# Altium schematic sheet Mainamp_schematic.SchDoc
size A4; SheetNumber: 3; SheetTotal: 3
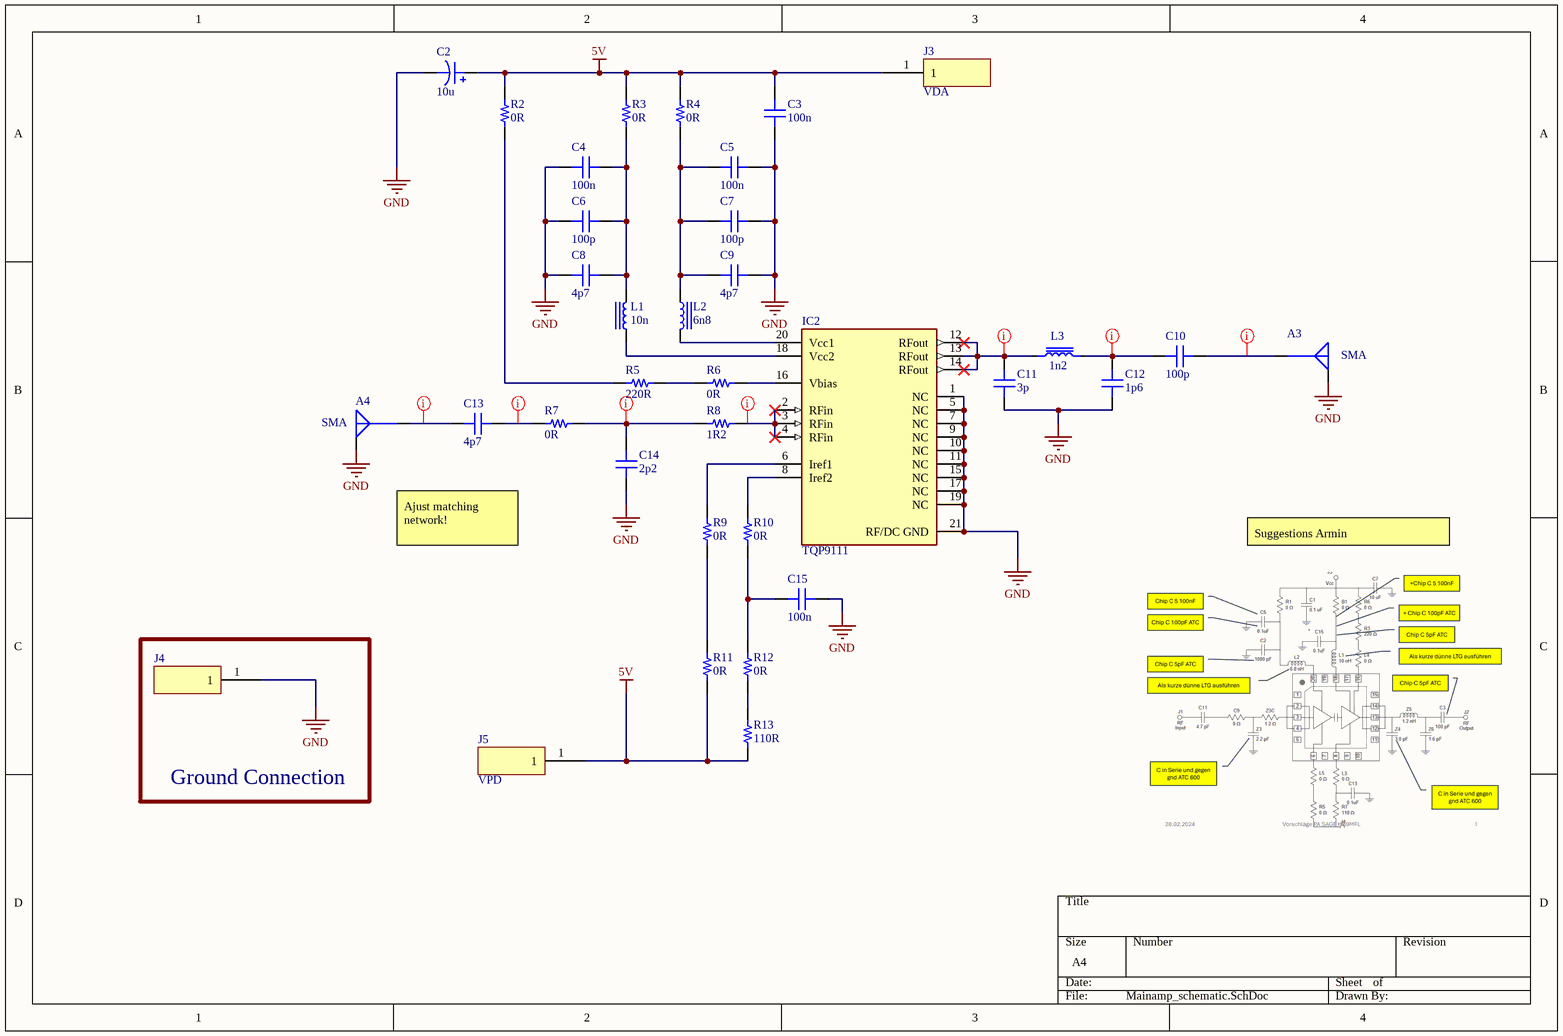
[diagram p0: Mainamp_schematic.SchDoc]

## Parts
A3  Connector Style: SMA  [MOLEX SD-73251-115]  (hidden comment: 0732511150)
A4  Connector Style: SMA  [MOLEX SD-73251-115]  (hidden comment: 0732511150)
C2  10u  [CAP POL 2917_7343]
C3  100n  [CAP 0603_1608]
C4  100n  [CAP 0603_1608]
C5  100n  [CAP 0603_1608]
C6  100p  [CAP 0603_1608 RF]
C7  100p  [CAP 0603_1608 RF]
C8  4p7  [CAP 0402_1005 RF]
C9  4p7  [CAP 0402_1005 RF]
C10  100p  [CAP 0402_1005 RF]
C11  3p  [CAP 0402_1005 RF]  (mechanical)
C12  1p6  [CAP 0402_1005 RF]  (mechanical)
C13  4p7  [CAP 0402_1005 RF]
C14  2p2  [CAP 0402_1005 RF]  (mechanical)
C15  100n  [CAP 0603_1608]
IC2  TQP9111  [FP-TQP9111-MFG]
J3  Nail_Head  [Nail_Head]  (value not drawn)
J4  Nail_Head  [Nail_Head]  (value not drawn)
J5  Nail_Head  [Nail_Head]  (value not drawn)
L1  10n  [IND 0603_1608 RF WW]
L2  6n8  [IND 0402_1005 RF WW]
L3  1n2  [0402]
R2  0R  [RES 0603_1608]
R3  0R  [RES 0603_1608]
R4  0R  [RES 0603_1608]
R5  220R  [RES 0603_1608]
R6  0R  [RES 0603_1608]
R7  0R  [RES 0402_1005]
R8  1R2  [RES 0402_1005]
R9  0R  [RES 0603_1608]
R10  0R  [RES 0603_1608]
R11  0R  [RES 0603_1608]
R12  0R  [RES 0603_1608]
R13  110R  [RES 0603_1608]

## Blocks framed on the sheet
Ground Connection: J4

## Nets
5V: C2.1 C3.2 J3.1 J5.1 R2.2 R3.2 R4.2 R11.1 R13.1
GND: A3.G A4.G C2.2 C3.1 C4.1 C5.2 C6.1 C7.2 C8.1 C9.2 C11.1 C12.1 C14.1 C15.2 IC2.1(NC) IC2.5(NC) IC2.7(NC) IC2.9(NC) IC2.10(NC) IC2.11(NC) IC2.15(NC) IC2.17(NC) IC2.19(NC) IC2.21(RF/DC_GND) J4.1
NetA3_S: A3.S C10.2
NetA4_S: A4.S C13.1
NetC4_2: C4.2 C6.2 C8.2 L1.2 R3.1
NetC5_1: C5.1 C7.1 C9.1 L2.2 R4.1
NetC10_1: C10.1 C12.2 L3.2
NetC11_2: C11.2 IC2.12(RFout) IC2.13(RFout) IC2.14(RFout) L3.1
NetC13_2: C13.2 R7.1
NetC14_2: C14.2 R7.2 R8.1
NetC15_1: C15.1 R10.1 R12.1
NetIC2_2: IC2.2(RFin) IC2.3(RFin) IC2.4(RFin) R8.2
NetIC2_6: IC2.6(Iref1) R9.2
NetIC2_8: IC2.8(Iref2) R10.2
NetIC2_16: IC2.16(Vbias) R6.1
NetIC2_18: IC2.18(Vcc2) L1.1
NetIC2_20: IC2.20(Vcc1) L2.1
NetR2_1: R2.1 R5.1
NetR5_2: R5.2 R6.2
NetR9_1: R9.1 R11.2
NetR12_2: R12.2 R13.2

## Layout directives
net class CPWG: NetA3_S, NetA4_S, NetC10_1, NetC11_2, NetC13_2, NetC14_2, NetIC2_2

## Notes on the sheet
- (near J3) VDA
- Ajust matching network!
- Suggestions Armin
- (near J5) VPD

## Library data of the parts
A3 A4 = 0732511150: CONN SMA RCPT STR 50OHM EDGE MNT; Manufacturer: Molex; Connector Type: Receptacle, Female Socket; Contact Termination: Solder; Frequency - Max: 18 GHz; Number of Ports: 1; Part Number: 0732511150; ComponentLink1Description: Datasheet; ComponentLink1URL: https://www.molex.com/pdm_docs/ps/PS-89675-346.pdf; ComponentLink2Description: DigiKey Link; ComponentLink2URL: https://www.digikey.com/en/products/detail/molex/0732511150/1465156; Fastening Type: Threaded; Housing Color: Gold; Impedance: 50Ohm; LastUpdated: 29/06/2022 18:06:18; Lifecycle Status: Active; Minimum Order: 1; Mounting Type: Board Edge, End Launch; Packaging: Tray; Part Status: Active; Price: 2.16; Series: 73251; Shield Termination: Solder; Supplier 1: DigiKey; Supplier Part Number 1: WM5534-ND
C2 = 293D106X0050E2TE3: CAP TANT 10UF 20% 50V 2917; manufacturer: Vishay Sprague; Manufacturer Size Code: E; Capacitance: 10 µF; ESR (Equivalent Series Resistance): 800mOhm; Type: Molded; Part Number: 293D106X0050E2TE3; Value: 10u; componentlink1description: Datasheet; componentlink1url: http://www.vishay.com/docs/40002/293d.pdf; componentlink2description: DigiKey Link; componentlink2url: https://www.digikey.com/en/products/detail/vishay-sprague/293D106X0050E2TE3/1578612; Device Package: 2917 (7343 Metric); Features: General Purpose; Height - Seated (Max): 0.170" (4.32mm); lastupdated: 26/04/2023 19:44:55; Lifecycle Status: Active; Minimum Order: 1; Mounting Type: Surface Mount; Operating Temperature: -55°C ~ 125°C; Package / Case: 2917 (7343 Metric); packaging: TapeAndReel; partid: 653; Part Status: Active; price: 0.69; series: TANTAMOUNT®, 293D; Size / Dimension: 0.287" L x 0.169" W (7.30mm x 4.30mm); Supplier 1: DigiKey; Supplier Part Number 1: 718-1957-1-ND; Tolerance: ±20%; Voltage - Rated: 50 V
C3-C5 C15 = C0603X104K5RAC3316: CAP CER 0603 0.1UF 50V X7R 10%; manufacturer: KEMET; Capacitance: 0.1 µF; Part Number: C0603X104K5RAC3316; Value: 100n; Applications: Automotive, Boardflex Sensitive; componentlink1description: Datasheet; componentlink1url: https://api.kemet.com/component-edge/download/datasheet/C0603X104K5RAC3316.pdf; componentlink2description: DigiKey Link; componentlink2url: https://www.digikey.com/en/products/detail/kemet/C0603X104K5RAC3316/10315788; Device Package: 0603 (1608 Metric); Features: Soft Termination; lastupdated: 26/04/2023 19:06:00; Lifecycle Status: Active; Minimum Order: 1; Mounting Type: Surface Mount, MLCC; Operating Temperature: -55°C ~ 125°C; Package / Case: 0603 (1608 Metric); packaging: TapeAndReel; partid: 11116; Part Status: Active; price: 0.02; Ratings: AEC-Q200; series: SMD Auto X7R VW80808; Size / Dimension: 0.063" L x 0.031" W (1.60mm x 0.80mm); Supplier 1: DigiKey; Supplier Part Number 1: 399-C0603X104K5RAC3316CT-ND; Temperature Coefficient: X7R; Thickness (Max): 0.037" (0.95mm); Tolerance: ±10%; Voltage - Rated: 50V
C6 C7 = 600S101GW250XT: CAP CER 100PF 250V NP0 0603; manufacturer: American Technical Ceramics; Temperature Coefficient: C0G, NP0; Tolerance: ±2%; Part Number: 600S101GW250XT; Applications: RF, Microwave, High Frequency, Bypass, Decoupling; Capacitance: 100 pF; componentlink1description: Datasheet; componentlink1url: http://www.atceramics.com/UserFiles/600s.pdf; componentlink2description: DigiKey Link; componentlink2url: https://www.digikey.com/en/products/detail/american-technical-ceramics/600S101GW250XT/3908987; Device Package: 0603 (1608 Metric); Features: High Q, Low Loss, Ultra Low ESR; lastupdated: 08/02/2024 21:16:59; Lifecycle Status: Active; Minimum Order: 1; Mounting Type: Surface Mount, MLCC; Operating Temperature: -55°C ~ 125°C; Package / Case: 0603 (1608 Metric); packaging: TapeAndReel; partid: 2165; Part Status: Active; price: 0.66; series: ATC 600S; Size / Dimension: 0.063" L x 0.032" W (1.60mm x 0.81mm); Supplier 1: DigiKey; Supplier Part Number 1: 1284-1931-1-ND; Thickness (Max): 0.035" (0.89mm); value: 100 pF; Voltage - Rated: 250V
C8 C9 C13 = 600L4R7BT200T: CAP CER 4.7PF 200V C0G/NP0 0402; manufacturer: American Technical Ceramics; Temperature Coefficient: C0G, NP0; Tolerance: ±0.1pF; Part Number: 600L4R7BT200T; Applications: RF, Microwave, High Frequency, Bypass, Decoupling; Capacitance: 4.7 pF; componentlink1description: Datasheet; componentlink1url: http://www.atceramics.com/UserFiles/600l.pdf; componentlink2description: DigiKey Link; componentlink2url: https://www.digikey.com/en/products/detail/american-technical-ceramics/600L4R7BT200T/3905170; Device Package: 0402 (1005 Metric); Features: High Q, Low Loss, Ultra Low ESR; lastupdated: 08/02/2024 21:11:52; Lifecycle Status: Active; Minimum Order: 1; Mounting Type: Surface Mount, MLCC; Operating Temperature: -55°C ~ 125°C; Package / Case: 0402 (1005 Metric); packaging: TapeAndReel; partid: 546; Part Status: Active; price: 0.28; series: ATC 600L; Size / Dimension: 0.040" L x 0.020" W (1.02mm x 0.51mm); Supplier 1: DigiKey; Supplier Part Number 1: 1284-1129-1-ND; Thickness (Max): 0.024" (0.60mm); value: 4.7 pF; Voltage - Rated: 200V
C10 = CBR04C101J3GAC: CAP CER 100PF 25V C0G/NP0 0402; manufacturer: KEMET; Temperature Coefficient: C0G, NP0; Tolerance: ±5%; Part Number: CBR04C101J3GAC; Applications: RF, Microwave, High Frequency; Capacitance: 100 pF; componentlink1description: Datasheet; componentlink1url: https://api.kemet.com/component-edge/download/datasheet/CBR04C101J3GAC.pdf; componentlink2description: DigiKey Link; componentlink2url: https://www.digikey.com/en/products/detail/kemet/CBR04C101J3GAC/8572519; Device Package: 0402 (1005 Metric); Features: High Q, Low Loss, Ultra Low ESR; lastupdated: 08/02/2024 21:11:51; Lifecycle Status: Active; Minimum Order: 1; Mounting Type: Surface Mount, MLCC; Operating Temperature: -55°C ~ 125°C; Package / Case: 0402 (1005 Metric); packaging: TapeAndReel; partid: 681; Part Status: Active; price: 0.02; series: CBR-SMD RF C0G; Size / Dimension: 0.039" L x 0.020" W (1.00mm x 0.50mm); Supplier 1: DigiKey; Supplier Part Number 1: 399-17684-1-ND; Thickness (Max): 0.022" (0.55mm); value: 100 pF; Voltage - Rated: 25V
C11 = 600L3R0AW200T: CAP CER 3PF 200V NP0 0402; manufacturer: American Technical Ceramics; Temperature Coefficient: C0G, NP0; Tolerance: ±0.05pF; Part Number: 600L3R0AW200T; Applications: RF, Microwave, High Frequency, Bypass, Decoupling; Capacitance: 3 pF; componentlink1description: Datasheet; componentlink1url: http://www.atceramics.com/UserFiles/600l.pdf; componentlink2description: DigiKey Link; componentlink2url: https://www.digikey.com/en/products/detail/american-technical-ceramics/600L3R0AW200T/3908948; Device Package: 0402 (1005 Metric); Features: High Q, Low Loss, Ultra Low ESR; lastupdated: 08/02/2024 21:11:49; Lifecycle Status: Active; Minimum Order: 1; Mounting Type: Surface Mount, MLCC; Operating Temperature: -55°C ~ 125°C; Package / Case: 0402 (1005 Metric); packaging: TapeAndReel; partid: 1331; Part Status: Active; price: 0.41; series: ATC 600L; Size / Dimension: 0.040" L x 0.020" W (1.02mm x 0.51mm); Supplier 1: DigiKey; Supplier Part Number 1: 478-12303-1-ND; Thickness (Max): 0.024" (0.60mm); value: 3 pF; Voltage - Rated: 200V
C12 = 600L1R6AT200T: CAP CER 1.6PF 200V C0G/NP0 0402; manufacturer: American Technical Ceramics; Temperature Coefficient: C0G, NP0; Tolerance: ±0.05pF; Part Number: 600L1R6AT200T; Applications: RF, Microwave, High Frequency, Bypass, Decoupling; Capacitance: 1.6 pF; componentlink1description: Datasheet; componentlink1url: http://www.atceramics.com/UserFiles/600l.pdf; componentlink2description: DigiKey Link; componentlink2url: https://www.digikey.com/en/products/detail/american-technical-ceramics/600L1R6AT200T/3905155; Device Package: 0402 (1005 Metric); Features: High Q, Low Loss, Ultra Low ESR; lastupdated: 08/02/2024 21:11:51; Lifecycle Status: Active; Minimum Order: 1; Mounting Type: Surface Mount, MLCC; Operating Temperature: -55°C ~ 125°C; Package / Case: 0402 (1005 Metric); packaging: TapeAndReel; partid: 766; Part Status: Active; price: 0.42; series: ATC 600L; Size / Dimension: 0.040" L x 0.020" W (1.02mm x 0.51mm); Supplier 1: DigiKey; Supplier Part Number 1: 1284-1111-1-ND; Thickness (Max): 0.024" (0.60mm); value: 1.6 pF; Voltage - Rated: 200V
C14 = 600L2R2BT200T: CAP CER 2.2PF 200V C0G/NP0 0402; manufacturer: American Technical Ceramics; Temperature Coefficient: C0G, NP0; Tolerance: ±0.1pF; Part Number: 600L2R2BT200T; Applications: RF, Microwave, High Frequency, Bypass, Decoupling; Capacitance: 2.2 pF; componentlink1description: Datasheet; componentlink1url: http://www.atceramics.com/UserFiles/600l.pdf; componentlink2description: DigiKey Link; componentlink2url: https://www.digikey.com/en/products/detail/american-technical-ceramics/600L2R2BT200T/3905162; Device Package: 0402 (1005 Metric); Features: High Q, Low Loss, Ultra Low ESR; lastupdated: 08/02/2024 21:11:48; Lifecycle Status: Active; Minimum Order: 1; Mounting Type: Surface Mount, MLCC; Operating Temperature: -55°C ~ 125°C; Package / Case: 0402 (1005 Metric); packaging: TapeAndReel; partid: 1591; Part Status: Active; price: 0.39; series: ATC 600L; Size / Dimension: 0.040" L x 0.020" W (1.02mm x 0.51mm); Supplier 1: DigiKey; Supplier Part Number 1: 1284-1120-1-ND; Thickness (Max): 0.024" (0.60mm); value: 2.2 pF; Voltage - Rated: 200V
IC2 = CMP-231850-000007-1: Amplifier, Power, 1.8 to 2.7 GHz, 29.8 dB, 32.5 dBm, SMT, 4 x 4 mm; RoHS Compliant: Yes
J3-J5 = Nail_Head: 1460-2-00-80-00-00-03-0 Mill-Max; Supplier 1: Farnell; Supplier Part Number 1: 3889056
L1 = LQW18AN10NG8ZD: FIXED IND 10NH 1.6A 52 MOHM; Manufacturer: Murata Electronics; DC Resistance (DCR): 52mOhm Max; Frequency - Self Resonant: 4.75GHz; Inductance Frequency - Test: 100MHz; Material - Core: Non-Magnetic; Q @ Freq: 38 @ 250MHz; Shielding: Unshielded; Tolerance: ±2%; Type: Wirewound; Part Number: LQW18AN10NG8ZD; ComponentLink1Description: Datasheet; ComponentLink1URL: https://search.murata.co.jp/Ceramy/image/img/P02/JELF243A-9133.pdf; ComponentLink2Description: DigiKey Link; ComponentLink2URL: http://digikey.com/product-detail/en/murata-electronics/LQW18AN10NG8ZD/490-15640-1-ND/6800305; Current Rating (Amps): 1.6A; Device Package: 0603 (1608 Metric); Height - Seated (Max): 0.039" (1.00mm); Inductance: 10nH; LastUpdated: 06/09/2020 11:05:21; Lifecycle Status: Active; Minimum Order: 1; Mounting Type: Surface Mount; Operating Temperature: -55°C ~ 125°C; Package / Case: 0603 (1608 Metric); Packaging: TapeAndReel; PartId: 1478; Part Status: Active; Price: 0.10; Ratings: AEC-Q200; Series: LQW18; Size / Dimension: 0.063" L x 0.031" W (1.60mm x 0.80mm); Supplier 1: DigiKey; Supplier Part Number 1: 490-15640-1-ND; Supplier Device Package: 0603 (1608 Metric); Value: 10nH
L2 = AISC-0402HP-6N8J-T: FIXED IND 6.8NH 1.4A 65 MOHM SMD; Manufacturer: Abracon LLC; DC Resistance (DCR): 65mOhm Max; Frequency - Self Resonant: 5.8GHz; Inductance Frequency - Test: 250 MHz; Material - Core: Ceramic; Q @ Freq: 25 @ 250MHz; Shielding: Unshielded; Tolerance: ±5%; Type: Drum Core, Wirewound; Part Number: AISC-0402HP-6N8J-T; ComponentLink1Description: Datasheet; ComponentLink1URL: https://abracon.com/Magnetics/inductors/AISC-0402HP.pdf; ComponentLink2Description: DigiKey Link; ComponentLink2URL: https://www.digikey.com/en/products/detail/abracon-llc/AISC-0402HP-6N8J-T/4215114; Current Rating (Amps): 1.4 A; Device Package: 0402 (1005 Metric); Height - Seated (Max): 0.024" (0.60mm); Inductance: 6.8 nH; LastUpdated: 26/04/2023 20:01:03; Lifecycle Status: Active; Minimum Order: 1; Mounting Type: Surface Mount; Operating Temperature: -40°C ~ 125°C; Package / Case: 0402 (1005 Metric); Packaging: TapeAndReel; PartId: 720; Part Status: Active; Price: 0.10; Series: AISC-0402HP; Size / Dimension: 0.039" L x 0.022" W (1.00mm x 0.55mm); Supplier 1: DigiKey; Supplier Part Number 1: 535-12227-1-ND; Supplier Device Package: 0402 (1005 Metric); Value: 6.8 nH
L3 = L_Coilcraft: Coilcraft 1.2nH 0402CS
R2-R4 R6 R9-R12 = JR0603X26E: 0603 26 AMP JUMPER; Manufacturer: Ohmite; Power (Watts): 0.135W; Resistance: 0 Ohms; Part Number: JR0603X26E; Value: 0R; ComponentLink1Description: Datasheet; ComponentLink1URL: https://www.ohmite.com/assets/docs/res_jr.pdf?r=false; ComponentLink2Description: DigiKey Link; ComponentLink2URL: https://www.digikey.com/en/products/detail/ohmite/JR0603X26E/10233371; Composition: Metal Element; Device Package: 0603 (1608 Metric); Height - Seated (Max): 0.022" (0.55mm); LastUpdated: 12/04/2023 19:32:57; Lifecycle Status: Active; Minimum Order: 1; Number of Terminations: 2; Operating Temperature: -55°C ~ 150°C; Package / Case: 0603 (1608 Metric); Packaging: TapeAndReel; PartId: 6812; Part Status: Active; Price: 0.10; Series: JR; Size / Dimension: 0.063" L x 0.031" W (1.60mm x 0.80mm); Supplier 1: DigiKey; Supplier Part Number 1: JR0603X26ECT-ND; Supplier Device Package: 0603; Tolerance: Jumper
R5 = CPF0603B220RE1: RES SMD 220 OHM 0.1% 1/16W 0603; Manufacturer: TE Connectivity Passive Product; Power (Watts): 0.063W, 1/16W; Resistance: 220 Ohms; Temperature Coefficient: ±25ppm/°C; Part Number: CPF0603B220RE1; Value: 220R; ComponentLink1Description: Datasheet; ComponentLink1URL: https://www.te.com/commerce/DocumentDelivery/DDEController?Action=srchrtrv&DocNm=1773200&DocType=DS&DocLang=English; ComponentLink2Description: DigiKey Link; ComponentLink2URL: https://www.digikey.com/en/products/detail/te-connectivity-passive-product/CPF0603B220RE1/2381904; Composition: Thin Film; Device Package: 0603 (1608 Metric); Height - Seated (Max): 0.022" (0.55mm); LastUpdated: 26/04/2023 19:28:28; Lifecycle Status: Active; Minimum Order: 1; Number of Terminations: 2; Operating Temperature: -55°C ~ 155°C; Package / Case: 0603 (1608 Metric); Packaging: TapeAndReel; PartId: 5753; Part Status: Active; Price: 0.12; Series: CPF, Neohm; Size / Dimension: 0.061" L x 0.031" W (1.55mm x 0.80mm); Supplier 1: DigiKey; Supplier Part Number 1: A103065CT-ND; Supplier Device Package: 0603; Tolerance: ±0.1%
R7 = PMR01ZZPJ000: RES SMD 0 OHM JUMPER 1/5W 0402; Manufacturer: Rohm Semiconductor; Power (Watts): 0.2W, 1/5W; Resistance: 0 Ohms; Temperature Coefficient: 0/ +200ppm/°C; Part Number: PMR01ZZPJ000; Value: 0R; ComponentLink1Description: Datasheet; ComponentLink1URL: https://www.rohm.com/datasheet/PMR01ZZPJ000/pmr-jpw-e; ComponentLink2Description: DigiKey Link; ComponentLink2URL: https://www.digikey.com/en/products/detail/rohm-semiconductor/PMR01ZZPJ000/5218667; Composition: Metal Element; Device Package: 0402 (1005 Metric); Features: Automotive AEC-Q200, Current Sense; Height - Seated (Max): 0.014" (0.35mm); LastUpdated: 09/02/2024 20:29:56; Lifecycle Status: Active; Minimum Order: 1; Number of Terminations: 2; Operating Temperature: -55°C ~ 155°C; Package / Case: 0402 (1005 Metric); Packaging: TapeAndReel; PartId: 9806; Part Status: Active; Price: 0.28; Ratings: AEC-Q200; Series: PMR; Size / Dimension: 0.039" L x 0.020" W (1.00mm x 0.50mm); Supplier 1: DigiKey; Supplier Part Number 1: RHM1692-1-ND; Supplier Device Package: 0402; Tolerance: Jumper
R8 = CRCW04021R20JNED: RES SMD 1.2 OHM 5% 1/16W 0402; Manufacturer: Vishay Dale; Power (Watts): 0.063W, 1/16W; Resistance: 1.2 Ohms; Temperature Coefficient: ±200ppm/°C; Part Number: CRCW04021R20JNED; Value: 1R2; ComponentLink1Description: Datasheet; ComponentLink1URL: http://www.vishay.com/docs/20035/dcrcwe3.pdf; ComponentLink2Description: DigiKey Link; ComponentLink2URL: https://www.digikey.com/en/products/detail/vishay-dale/CRCW04021R20JNED/1177498; Composition: Thick Film; Device Package: 0402 (1005 Metric); Features: Automotive AEC-Q200; Height - Seated (Max): 0.016" (0.40mm); LastUpdated: 26/04/2023 19:20:40; Lifecycle Status: Active; Minimum Order: 1; Number of Terminations: 2; Operating Temperature: -55°C ~ 155°C; Package / Case: 0402 (1005 Metric); Packaging: CutTape; PartId: 2883; Part Status: Active; Price: 0.01; Ratings: AEC-Q200; Series: CRCW; Size / Dimension: 0.039" L x 0.020" W (1.00mm x 0.50mm); Supplier 1: DigiKey; Supplier Part Number 1: 541-1.2JCT-ND; Supplier Device Package: 0402; Tolerance: ±5%
R13 = RN73H1JTTD1100B25: RES 110 OHM 0.1% 1/10W 0603; Manufacturer: KOA Speer Electronics, Inc.; Power (Watts): 0.1W, 1/10W; Resistance: 110 Ohms; Temperature Coefficient: ±25ppm/°C; Part Number: RN73H1JTTD1100B25; Value: 110R; ComponentLink2Description: DigiKey Link; ComponentLink2URL: https://www.digikey.com/en/products/detail/koa-speer-electronics-inc/RN73H1JTTD1100B25/10685623; Composition: Metal Film; Device Package: 0603 (1608 Metric); Features: Automotive AEC-Q200, Moisture Resistant; Height - Seated (Max): 0.022" (0.55mm); LastUpdated: 26/04/2023 19:26:31; Lifecycle Status: Active; Minimum Order: 1; Number of Terminations: 2; Operating Temperature: -55°C ~ 155°C; Package / Case: 0603 (1608 Metric); Packaging: TapeAndReel; PartId: 71509; Part Status: Active; Price: 0.09; Ratings: AEC-Q200; Series: RN73H; Size / Dimension: 0.063" L x 0.031" W (1.60mm x 0.80mm); Supplier 1: DigiKey; Supplier Part Number 1: 2019-RN73H1JTTD1100B25CT-ND; Supplier Device Package: 0603; Tolerance: ±0.1%